# EAGLE design Wifi Shield v1.2 (EAGLE 6.4)
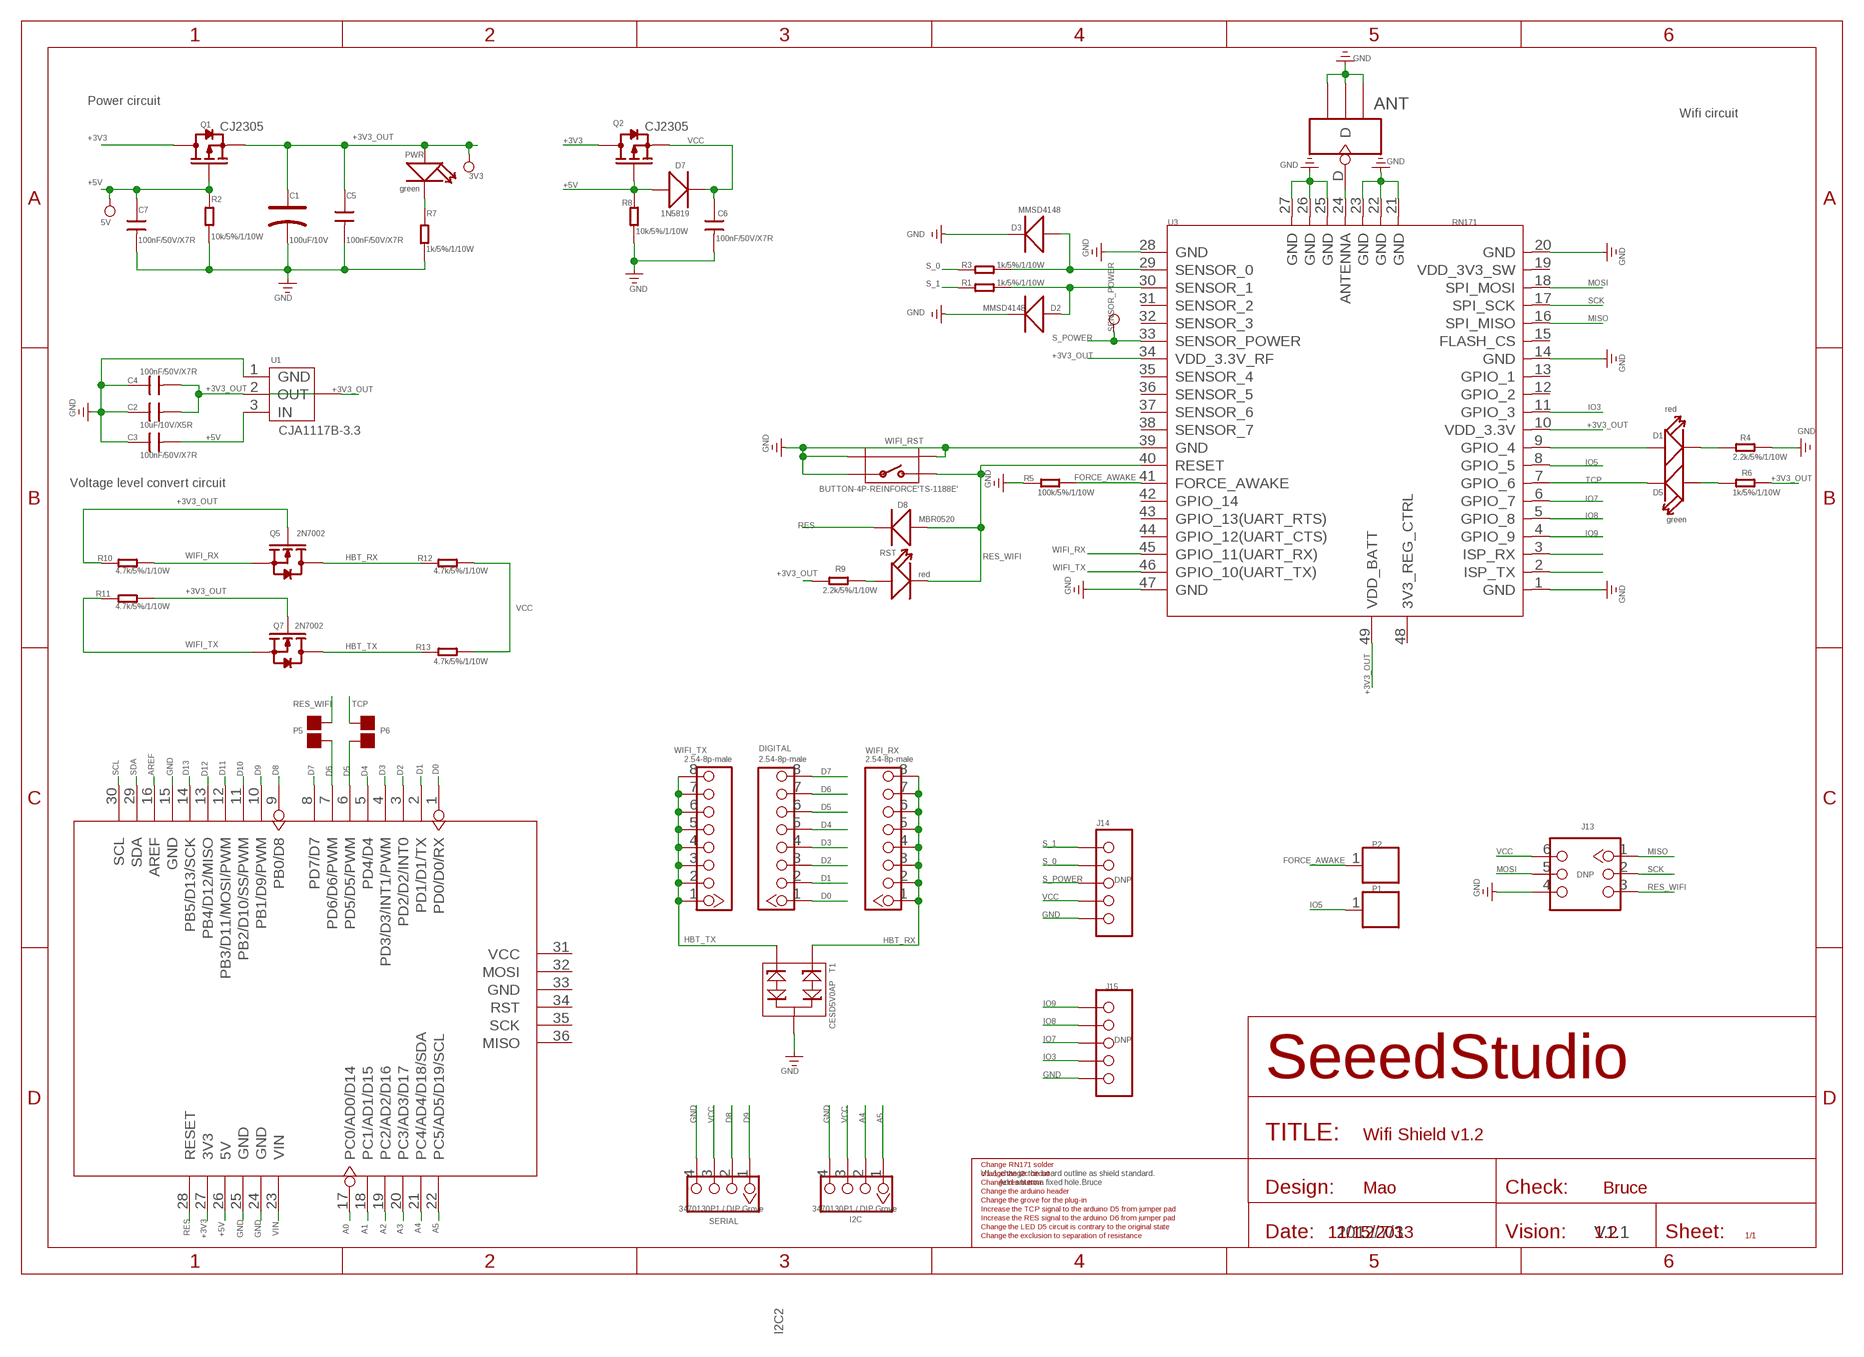
[diagram p0: schematic, sheet 1]

## Parts
3V3  PAD-TEST-POINT-CIRCLE_SIZE_3030  [TP_3535]
5V  PAD-TEST-POINT-CIRCLE_SIZE_3030  [TP_3535]
ANT1  ANT  ANTENNA-U-FL  [4P-U-FL]
C1  100uF/10V  CAP-AVX-B  [AVX-B]
C2  10uF/10V/X5R  C-0603  [0603]
C3  100nF/50V/X7R  C-0603  [0603]
C4  100nF/50V/X7R  C-0603  [0603]
C5  100nF/50V/X7R  C-0603  [0603]
C6  100nF/50V/X7R  C-0603  [0603]
C7  100nF/50V/X7R  C-0603  [0603]
D1  red  LED'0603'  [LED-0603]
D2  MMSD4148  D-MBR0520LT1  [SOD123-2.7X1.6]
D3  MMSD4148  D-MBR0520LT1  [SOD123-2.7X1.6]
D5  green  LED'0603'  [LED-0603]
D7  1N5819  D-SMA  [D2010]
D8  MBR0520  D-MBR0520LT1  [SOD123-2.7X1.6]
DIGITAL  2.54-8p-male  HEADER-8P-2.54  [8P-2.54]
I2C  3470130P1 / DIP Grove  TWIG-4P-2.0-2.0  [4P-2.0]
J13  DNP  HEADER-2X3P-2.54  [2X3P-2.54]
J14  DNP  HEADER-5P-2.54  [5P-2.54]
J15  DNP  HEADER-5P-2.54  [5P-2.54]
P1  DNP  PAD'60/30'  [1P-65/35MIL]
P2  DNP  PAD'60/30'  [1P-65/35MIL]
P5  DNP  PAD-JUMPER-2P  [2P-SMD-1.78X1.27]
P6  DNP  PAD-JUMPER-2P  [2P-SMD-1.78X1.27]
PWR  green  LED'0603'  [LED-0603]
Q1  CJ2305  MOSFET-P'SI2323CDS/SI2305DS<BR>'  [SOT23]
Q2  CJ2305  MOSFET-P'SI2323CDS/SI2305DS<BR>'  [SOT23]
Q5  2N7002  MOSFET-N'SOT23'  [SOT23]
Q7  2N7002  MOSFET-N'SOT23'  [SOT23]
R1  1k/5%/1/10W  R-0603  [0603]
R2  10k/5%/1/10W  R-0603  [0603]
R3  1k/5%/1/10W  R-0603  [0603]
R4  2.2k/5%/1/10W  R-0603  [0603]
R5  100k/5%/1/10W  R-0603  [0603]
R6  1k/5%/1/10W  R-0603  [0603]
R7  1k/5%/1/10W  R-0603  [0603]
R8  10k/5%/1/10W  R-0603  [0603]
R9  2.2k/5%/1/10W  R-0603  [0603]
R10  4.7k/5%/1/10W  R-0603  [0603]
R11  4.7k/5%/1/10W  R-0603  [0603]
R12  4.7k/5%/1/10W  R-0603  [0603]
R13  4.7k/5%/1/10W  R-0603  [0603]
RST  red  LED'0603'  [LED-0603]
SENSOR_POWER  PAD-TEST-POINT-CIRCLE_SIZE_3030  [TP_3535]
SERIAL  3470130P1 / DIP Grove  TWIG-4P-2.0-2.0  [4P-2.0]
T1  CESD5V0AP  D-ESD-PESDXL2BT  [SOT23]
U1  CJA1117B-3.3  LD1117SOT89  [SOT89]
U2  ARDUINO'W/O-SILK'  [ARDUINO-W/O-SILK]
U3  RN171  WIFI-RN-171  [49P-1.27-26.67X17.78]
WIFI_RST  BUTTON-4P-REINFORCE'TS-1188E'  [4P-SMD-7X3.5X3.5H]
WIFI_RX  2.54-8p-male  HEADER-8P-2.54  [8P-2.54]
WIFI_TX  2.54-8p-male  HEADER-8P-2.54  [8P-2.54]

## Nets
+3V3: Q1.3(D) Q2.3(D) U2.27(3V3)
+3V3_OUT: 3V3.T C1.+ C2.2 C4.2 C5.1 PWR.+ Q1.2(S) Q5.1(G) Q7.1(G) R6.1 R9.2 R10.2 R11.1 U1.2(OUT) U1.4(TAB) U3.10(VDD_3.3V) U3.34(VDD_3.3V_RF) U3.49(VDD_BATT)
+5V: 5V.T C3.2 C7.1 D7.+ Q1.1(G) Q2.1(G) R2.1 R8.1 U1.3(IN) U2.26(5V)
A0: U2.17(PC0/AD0/D14)
A1: U2.18(PC1/AD1/D15)
A2: U2.19(PC2/AD2/D16)
A3: U2.20(PC3/AD3/D17)
A4: I2C.2 U2.21(PC4/AD4/D18/SDA)
A5: I2C.1 U2.22(PC5/AD5/D19/SCL)
AREF: U2.16(AREF)
D0: DIGITAL.1 U2.1(PD0/D0/RX)
D1: DIGITAL.2 U2.2(PD1/D1/TX)
D2: DIGITAL.3 U2.3(PD2/D2/INT0)
D3: DIGITAL.4 U2.4(PD3/D3/INT1/PWM)
D4: DIGITAL.5 U2.5(PD4/D4)
D5: DIGITAL.6 P6.2 U2.6(PD5/D5/PWM)
D6: DIGITAL.7 P5.1 U2.7(PD6/D6/PWM)
D7: DIGITAL.8 U2.8(PD7/D7)
D8: SERIAL.2 U2.9(PB0/D8)
D9: SERIAL.1 U2.10(PB1/D9/PWM)
D10: U2.11(PB2/D10/SS/PWM)
D11: U2.12(PB3/D11/MOSI/PWM)
D12: U2.13(PB4/D12/MISO)
D13: U2.14(PB5/D13/SCK)
FORCE_AWAKE: P2.1 R5.1 U3.41(FORCE_AWAKE)
GND: ANT1.GND1 ANT1.GND2 ANT1.GND3 C1.- C2.1 C3.1 C4.1 C5.2 C6.2 C7.2 D2.1(-) D3.1(-) I2C.4 J13.4 J14.5 J15.5 R2.2 R4.1 R5.2 R7.1 R8.2 SERIAL.4 T1.3 U1.1(GND) U2.15(GND) U2.24(GND) U2.25(GND) U3.1(GND) U3.14(GND) U3.20(GND) U3.21(GND) U3.22(GND) U3.23(GND) U3.25(GND) U3.26(GND) U3.27(GND) U3.28(GND) U3.39(GND) U3.47(GND) WIFI_RST.1 WIFI_RST.S1 WIFI_RST.S2
HBT_RX: Q5.3(D) R12.2 T1.1 WIFI_RX.1 WIFI_RX.2 WIFI_RX.3 WIFI_RX.4 WIFI_RX.5 WIFI_RX.6 WIFI_RX.7 WIFI_RX.8
HBT_TX: Q7.3(D) R13.2 T1.2 WIFI_TX.1 WIFI_TX.2 WIFI_TX.3 WIFI_TX.4 WIFI_TX.5 WIFI_TX.6 WIFI_TX.7 WIFI_TX.8
IO3: J15.4 U3.11(GPIO_3)
IO5: P1.1 U3.8(GPIO_5)
IO7: J15.3 U3.6(GPIO_7)
IO8: J15.2 U3.5(GPIO_8)
IO9: J15.1 U3.4(GPIO_9)
MISO: J13.1 U3.16(SPI_MISO)
MOSI: J13.5 U3.18(SPI_MOSI)
N$1: R9.1 RST.+
N$2: D3.2(+) R3.1 U3.29(SENSOR_0)
N$3: D2.2(+) R1.1 U3.30(SENSOR_1)
N$4: D5.+ R6.2
N$10: U3.2(ISP_TX)
N$11: U3.3(ISP_RX)
N$20: ANT1.D U3.24(ANTENNA)
N$22: D1.+ U3.9(GPIO_4)
N$25: D1.- R4.2
N$26: PWR.- R7.2
RES: D8.1(-) U2.28(RESET)
RES_WIFI: D8.2(+) J13.3 P5.2 RST.- U3.40(RESET) WIFI_RST.2
S_0: J14.2 R3.2
S_1: J14.1 R1.2
S_POWER: J14.3 SENSOR_POWER.T U3.33(SENSOR_POWER)
SCK: J13.2 U3.17(SPI_SCK)
SCL: U2.30(SCL)
SDA: U2.29(SDA)
TCP: D5.- P6.1 U3.7(GPIO_6)
VCC: C6.1 D7.- I2C.3 J13.6 J14.4 Q2.2(S) R12.1 R13.1 SERIAL.3
VIN: U2.23(VIN)
WIFI_RX: Q5.2(S) R10.1 U3.45(GPIO_11(UART_RX))
WIFI_TX: Q7.2(S) R11.2 U3.46(GPIO_10(UART_TX))
Unconnected: U2.31(VCC) U2.32(MOSI) U2.33(GND) U2.34(RST) U2.35(SCK) U2.36(MISO) U3.12(GPIO_2) U3.13(GPIO_1) U3.15(FLASH_CS) U3.19(VDD_3V3_SW) U3.31(SENSOR_2) U3.32(SENSOR_3) U3.35(SENSOR_4) U3.36(SENSOR_5) U3.37(SENSOR_6) U3.38(SENSOR_7) U3.42(GPIO_14) U3.43(GPIO_13(UART_RTS)) U3.44(GPIO_12(UART_CTS)) U3.48(3V3_REG_CTRL)

## Notes on the sheet
- Power circuit
- Wifi circuit
- Voltage level convert circuit
- Change RN171 solder
- change the i2c circuit | V1.1:change the board outline as shield standard.
- Change res button | Add antenna fixed hole.Bruce
- Change the arduino header | Mao | Bruce
- Change the grove for the plug-in
- Increase the TCP signal to the arduino D5 from jumper pad
- Increase the RES signal to the arduino D6 from jumper pad
- Change the LED D5 circuit is contrary to the original state
- Change the exclusion to separation of resistance | 11/15/2013 | 2012/7/3 | 1.2 | V1.1
- I2C2

## Library data of the parts
3V3 5V SENSOR_POWER = Discrete:PAD-TEST-POINT-CIRCLE
ANT1 = Connector :ANTENNA-U-FL
C1 = Discrete:CAP*: Electrolytic Capacitors,Tantalum Capacitors and Super Capacitors
C2-C7 = Discrete:C*: Ceramic Capacitors
D1 D5 PWR RST = Discrete:LED*
D2 D3 D7 D8 = Discrete:D*
DIGITAL WIFI_RX WIFI_TX = Connector:HEADER-8P
I2C SERIAL = Connector:TWIG-4P-2.0
J13 = Connector:HEADER-2X3P
J14 J15 = Connector:HEADER-5P
P1 P2 = Discrete:PAD
P5 P6 = Discrete:PAD-JUMPER-2P; PARTNO: DNP
Q1 Q2 = Discrete:MOSFET-P
Q5 Q7 = Discrete:MOSFET-N: IRLL014: http://www.vishay.com/docs/91319/sihll014.pdf
R1-R13 = Discrete:R*
T1 = Discrete:D-ESD-PESDXL2BT
U1 = IC:LD1117: Low Drop Fixed And Adjustable Positive Voltage Regulators http://www.datasheetcatalog.org/datasheet/SGSThomsonMicroelectronics/mXuqtqv.pdf
U2 = template:ARDUINO
U3 = moudle:WIFI-RN-171: WIFLY GSX 802.11 b/g wireless LAN Module
WIFI_RST = Discrete:BUTTON-4P-REINFORCE: TS-1188E http://www.best-dz.com/?thread-374-2.html

## Net classes
0 default: width 0.003 mm, drill 0.254 mm, clearance 0.152 mm

## Board
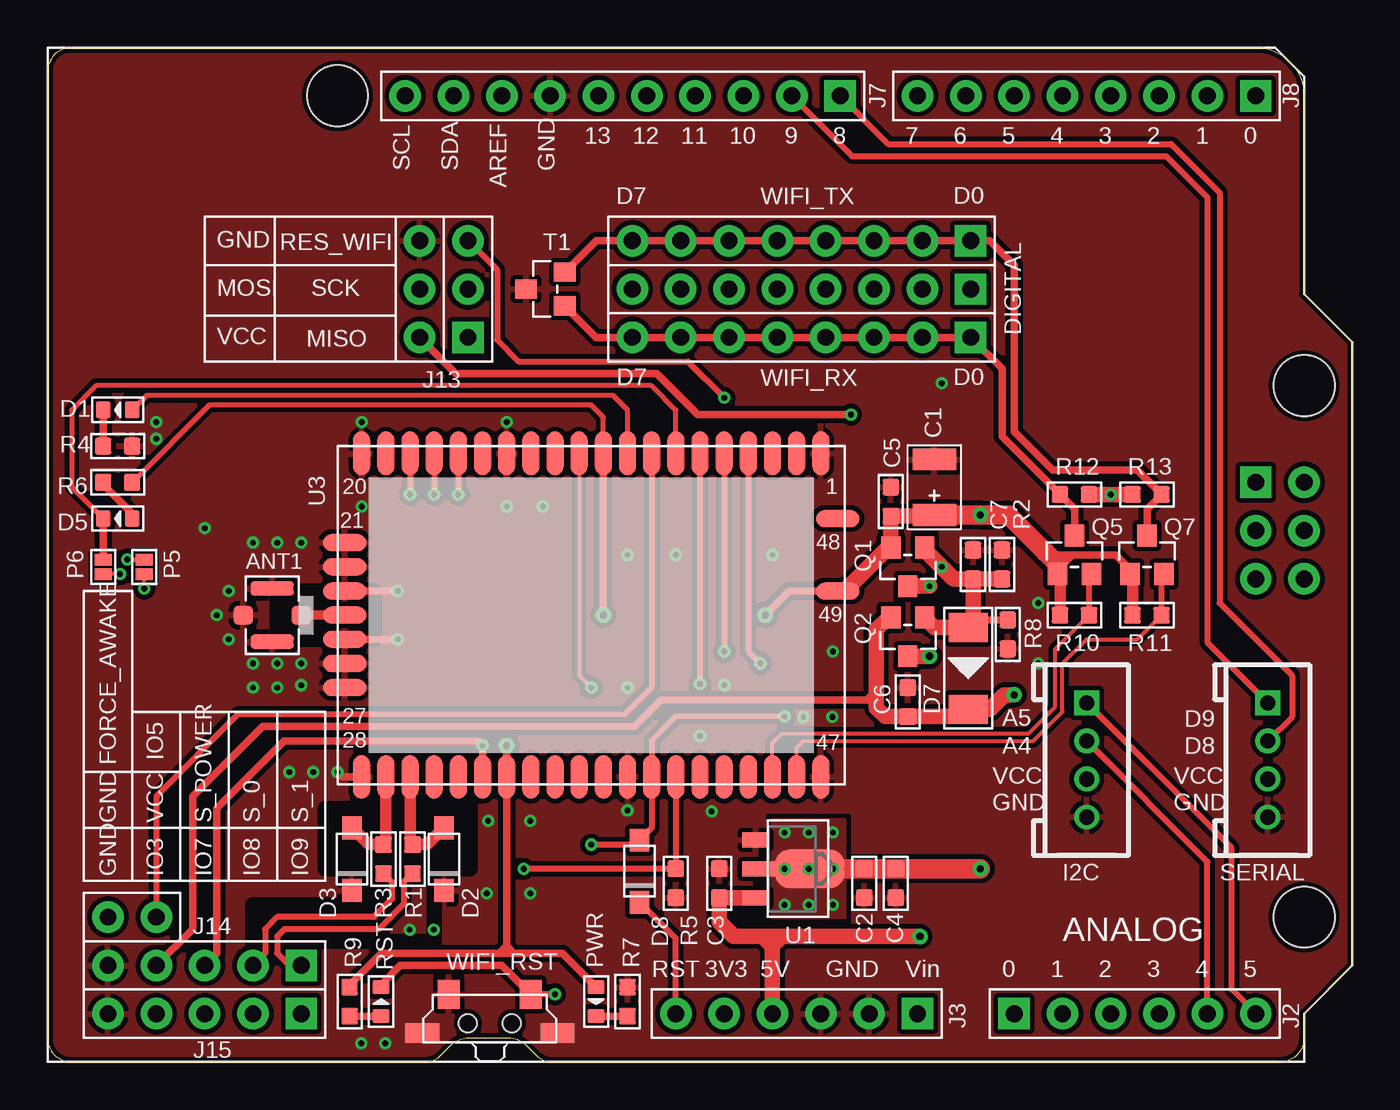
[diagram p1: board, top side]
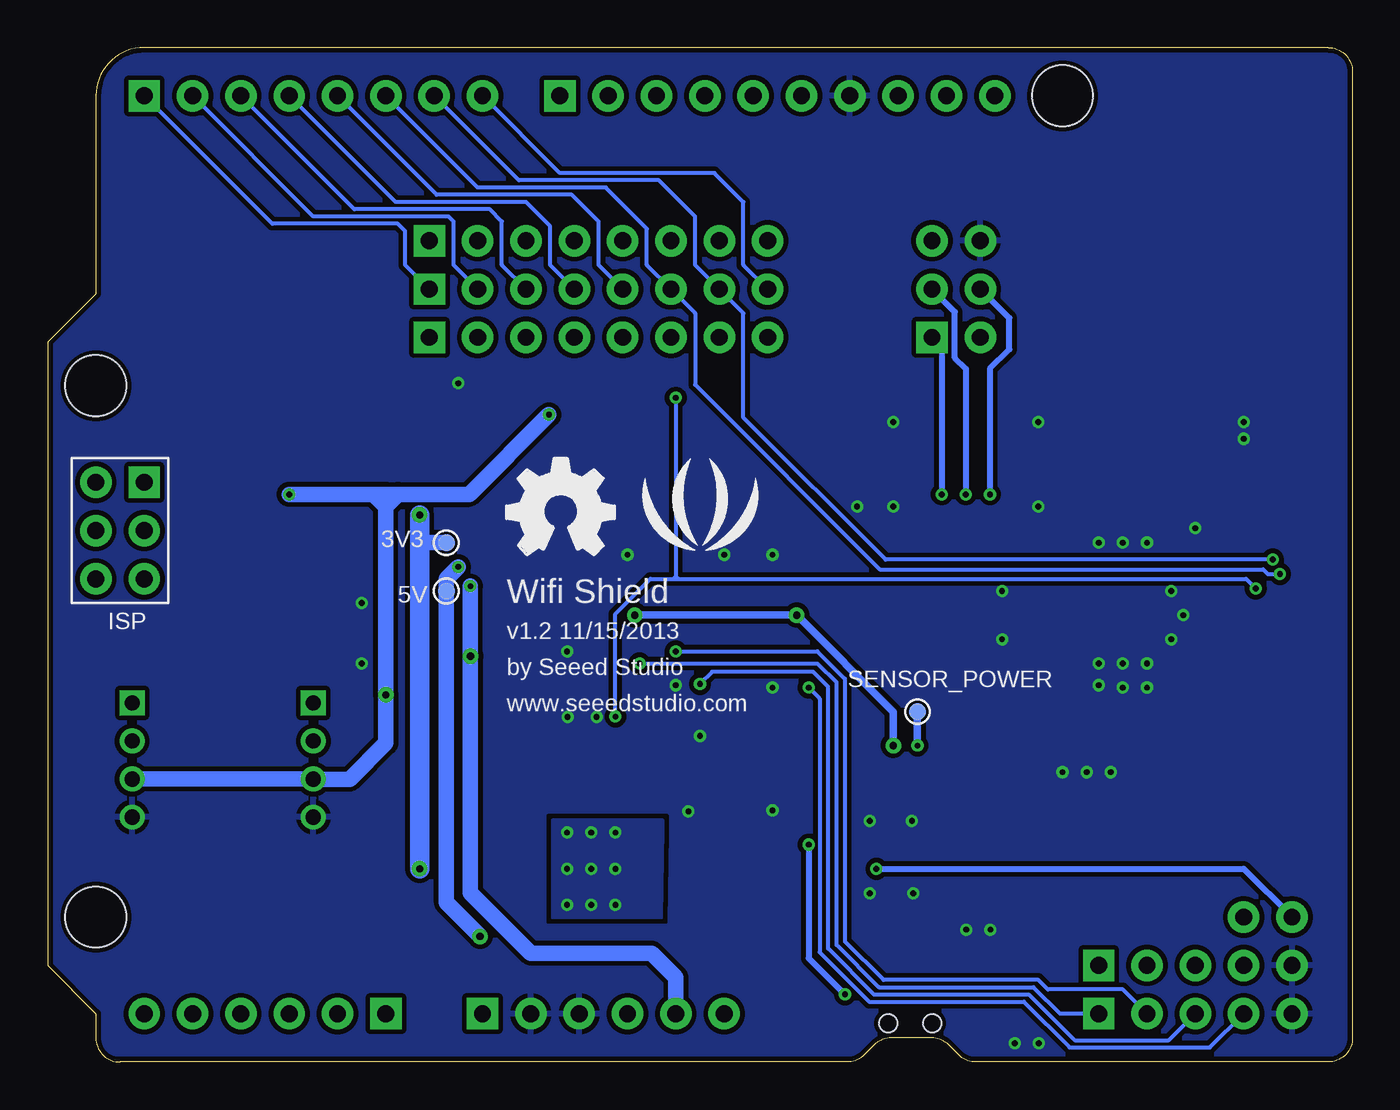
[diagram p2: board, bottom side, seen from below]

Size 68.58 x 53.34 mm. Coordinates in mm from the lower left corner, seen from the top.
Outline: 1.27,53.34 63.5,53.34 arc-90 66.04,50.8 66.04,40.39 68.58,37.85 68.58,5.08 66.04,2.54 66.04,1.27 arc-90 64.77,0 26.56,0 arc-45 25.66,0.37 25.14,0.9 arc45 24.24,1.27 22.12,1.27 arc45 21.22,0.9 20.69,0.37 arc-45 19.79,0 1.27,0 arc-90 0,1.27 0,52.07 arc-90 1.27,53.34
Copper layers (1*16): Top 0.035mm / dielectric 1.5mm / Bottom 0.035mm
Design rules "default": minimum track width 6mil, minimum drill 12mil, track to track 6mil, track to pad 6mil, pad to pad 6mil, via to via 6mil, smd to smd 0mil, copper to edge 10mil, drill to drill 10mil, minimum pad ring 10mil, minimum via ring 6mil, stop-mask expansion 2mil, vias tented up to drill 32mil, thermal gap 10mil
tRestrict: 18 lines

### Footprints (pad centres in the part's own frame; a part is rotated, then mirrored left to right if it is on the bottom)
TP_3535 = smd 0.889 x 0.889: T 0,0
4P-U-FL = smd 1.016 x 1.016: D -1.524,0; GND3 1.524,0 | smd 2.286 x 0.762: GND1 0,1.397; GND2 0,-1.397
AVX-B = smd 1.143 x 2.286: + -1.46,0; - 1.46,0
0603 = smd 0.889 x 0.889: 1 -0.762,0; 2 0.762,0
LED-0603 = smd 0.762 x 0.889: + -0.762,0; - 0.762,0
SOD123-2.7X1.6 = smd 1.2 x 1.02: 1 -1.635,0; 2 1.635,0
D2010 = smd 1.524 x 2.032: + -2.159,0; - 2.159,0
8P-2.54 = drill 0.889 pad 1.651 square: 1 0,8.89 | drill 0.889 pad 1.651: 2 0,6.35; 3 0,3.81; 4 0,1.27; 5 0,-1.27; 6 0,-3.81; 7 0,-6.35; 8 0,-8.89
4P-2.0 = drill 0.8 pad 1.27 square: 1 -3,0 | drill 0.8 pad 1.27: 2 -1,0; 3 1,0; 4 3,0
2X3P-2.54 = drill 0.889 pad 1.651 square: 1 -1.27,2.54 | drill 0.889 pad 1.651: 2 -1.27,0; 3 -1.27,-2.54; 4 1.27,-2.54; 5 1.27,0; 6 1.27,2.54
5P-2.54 = drill 0.889 pad 1.651 square: 1 0,5.08 | drill 0.889 pad 1.651: 2 0,2.54; 3 0,0; 4 0,-2.54; 5 0,-5.08
1P-65/35MIL = drill 0.889 pad 1.651: 1 0,0
2P-SMD-1.78X1.27 = smd 0.889 x 0.61: 1 0,0.381; 2 0,-0.381
SOT23 = smd 1.016 x 1.143: 1 -0.889,-1.016; 2 0.889,-1.016; 3 0,1.016
SOT89 = smd 0.8 x 1.4: 1 -1.524,-1.905; 3 1.524,-1.905 | smd 0.8 x 1.9: 2 0,-1.651 | smd 2.032 x 3.65: 4 0,0.94
ARDUINO-W/O-SILK = drill 0.889 pad 1.651 square: 1 63.5,50.8; 9 41.656,50.8; 17 50.8,2.54; 23 45.72,2.54; 36 63.5,30.48 | drill 0.889 pad 1.651: 2 60.96,50.8; 3 58.42,50.8; 4 55.88,50.8; 5 53.34,50.8; 6 50.8,50.8; 7 48.26,50.8; 8 45.72,50.8; 10 39.116,50.8; 11 36.576,50.8; 12 34.036,50.8; 13 31.496,50.8; 14 28.956,50.8; 15 26.416,50.8; 16 23.876,50.8; 18 53.34,2.54; 19 55.88,2.54; 20 58.42,2.54; 21 60.96,2.54; 22 63.5,2.54; 24 43.18,2.54; 25 40.64,2.54; 26 38.1,2.54; 27 35.56,2.54; 28 33.02,2.54; 29 21.336,50.8; 30 18.796,50.8; 31 66.04,30.48; 32 66.04,27.94; 33 66.04,25.4; 34 63.5,25.4; 35 63.5,27.94 | hole 3.2: 15.24,50.8; 66.04,35.56; 66.04,7.62
49P-1.27-26.67X17.78 = smd 0.889 x 2.286: 1 12.065,8.509; 2 10.795,8.509; 3 9.525,8.509; 4 8.255,8.509; 5 6.985,8.509; 6 5.715,8.509; 7 4.445,8.509; 8 3.175,8.509; 9 1.905,8.509; 10 0.635,8.509; 11 -0.635,8.509; 12 -1.905,8.509; 13 -3.175,8.509; 14 -4.445,8.509; 15 -5.715,8.509; 16 -6.985,8.509; 17 -8.255,8.509; 18 -9.525,8.509; 19 -10.795,8.509; 20 -12.065,8.509; 28 -12.065,-8.509; 29 -10.795,-8.509; 30 -9.525,-8.509; 31 -8.255,-8.509; 32 -6.985,-8.509; 33 -5.715,-8.509; 34 -4.445,-8.509; 35 -3.175,-8.509; 36 -1.905,-8.509; 37 -0.635,-8.509; 38 0.635,-8.509; 39 1.905,-8.509; 40 3.175,-8.509; 41 4.445,-8.509; 42 5.715,-8.509; 43 6.985,-8.509; 44 8.255,-8.509; 45 9.525,-8.509; 46 10.795,-8.509; 47 12.065,-8.509 | smd 2.286 x 0.889: 21 -12.954,3.81; 22 -12.954,2.54; 23 -12.954,1.27; 24 -12.954,0; 25 -12.954,-1.27; 26 -12.954,-2.54; 27 -12.954,-3.81; 48 12.954,5.08; 49 12.954,1.27
4P-SMD-7X3.5X3.5H = smd 1.143 x 1.524: 1 -2.159,1.524; 2 2.159,1.524 | smd 1.778 x 1.016: S1 -3.556,-0.508; S2 3.556,-0.508 | hole 0.95: -1.15,0; 1.15,0

### Placement (x,y rotation side)
3V3  47.62,27.3 180 bottom
5V  47.62,24.77 0 bottom
ANT1  11.81,23.5 180 top
C1  46.61,30.23 90 top
C2  42.93,9.4 90 top
C3  35.31,9.4 270 top
C4  44.58,9.4 90 top
C5  44.32,29.46 90 top
C6  45.21,18.92 90 top
C7  48.64,26.16 90 top
D1  3.68,34.29 180 top
D2  20.83,10.67 90 top
D3  16,10.67 90 top
D5  3.68,28.57 180 top
D7  48.39,20.7 270 top
D8  31.11,10.03 90 top
DIGITAL  39.62,40.64 270 top
I2C  54.61,15.88 270 top
J13  20.83,40.64 180 top
J14  8.26,5.08 270 top
J15  8.26,2.54 270 top
P1  5.71,7.62 0 top
P2  3.17,7.62 0 top
P5  5.08,26.04 0 top
P6  2.92,26.04 0 top
PWR  28.83,3.17 270 top
Q1  45.21,26.04 180 top
Q2  45.21,22.35 180 top
Q5  53.98,26.67 0 top
Q7  57.78,26.67 0 top
R1  19.18,10.67 270 top
R2  50.16,26.16 90 top
R3  17.65,10.67 270 top
R4  3.68,32.38 180 top
R5  33.02,9.4 270 top
R6  3.68,30.48 180 top
R7  30.48,3.17 270 top
R8  50.47,22.48 270 top
R9  15.88,3.17 90 top
R10  53.98,23.5 180 top
R11  57.78,23.5 0 top
R12  53.98,29.84 180 top
R13  57.78,29.84 0 top
RST  17.53,3.17 90 top
SENSOR_POWER  22.86,18.41 0 bottom
SERIAL  64.14,15.88 270 top
T1  26.16,40.64 90 top
U1  39.12,10.16 270 top
U2  0,0 0 top
U3  28.57,23.5 0 top
U$1  [OSHW_FILLX200_NOTEXT]  44.45,26.67 0 bottom
U$2  [LOGO_SILK]  34.29,28.57 0 bottom
WIFI_RST  23.24,2.03 0 top
WIFI_RX  39.62,38.1 270 top
WIFI_TX  39.62,43.18 270 top

### Tracks (layer width: path | path; a pad name or v marks a point on that pad's centre or on a via)
+3V3  (via drill 0.3 pad 0.64, 0.38 pad 0.81)
  Top 0.813: Q2.3 v46.35,21.34 | v46.35,25.02 Q1.3
  Bottom 0.813: v46.35,25.02 v46.35,21.34 46.35,8.89 43.18,5.71 36.83,5.71 35.56,4.45 U2.27
+3V3_OUT  (via drill 0.3 pad 0.64, 0.38 pad 0.81)
  Top 0.254: U3.10 29.21,33.91 28.57,34.54 8.51,34.54 R6.1
  Top 0.406: Q7.1 56.9,25.91 56.13,26.67 53.85,26.67 | 53.85,26.67 53.09,25.91 Q5.1 | 53.85,26.67 52.58,26.67 52.45,26.8 | v29.21,23.5 U3.10 | v24.13,16.64 U3.34 24.13,6.1 | 24.13,6.1 24.13,5.71 | R9.2 15.88,4.06 17.53,5.71 23.75,5.71 | PWR.+ 27.05,5.71 24.51,5.71 | 24.13,5.71 24.51,5.71 | 41.91,24.77 U3.49 38.99,24.77 v37.72,23.5 | 24.13,6.1 24.51,5.71 | 24.13,6.1 23.75,5.71 | 23.75,5.71 24.13,5.71
  Top 0.61: R10.2 53.21,25.53 Q5.1 53.09,26.16 | R11.1 57.02,25.53 Q7.1
  Top 0.813: 41.91,24.77 44.2,27.05 Q1.2 C5.1 46.55,28.7 C1.+ 47.31,28.77 | C4.2 C2.2 v41.27,10.16 U1.4 U1.2
  Top 1.016: v49.02,10.16 C4.2 v41.27,10.16 | 53.09,26.16 52.45,26.8 50.48,28.77 v49.02,28.77 47.31,28.77
  Bottom 0.406: v37.72,23.5 v29.21,23.5 24.13,18.41 v24.13,16.64
  Bottom 0.813: 3V3.T 48.9,27.3 49.02,27.43
  Bottom 1.016: v49.02,10.16 49.02,27.43 v49.02,28.77
  other vias: 38.73,12.06 38.73,10.16 38.73,8.26 41.27,8.26 41.27,12.06 40.01,12.06 40.01,10.16 40.01,8.26
  pour Top (isolate 0.254, no thermals): 41.91,12.7 38.1,12.7 38.1,7.62 41.91,7.62
  pour Bottom (isolate 0.254, no thermals): 36.26,12.26 36.26,12.7 42.04,12.7 42.04,7.62 36.32,7.62
+5V  (via drill 0.3 pad 0.64, 0.38 pad 0.81)
  Top 0.406: R8.1 48.77,23.24
  Top 0.813: D7.+ 46.61,22.86 Q2.1 | D7.+ 48.64,23.11 C7.1 | 48.77,23.24 D7.+ | U1.3 C3.2 35.31,7.37 36.07,6.6 37.59,6.6 | v45.85,6.6 37.97,6.6 | 37.97,6.6 37.59,6.6 | 38.1,6.1 38.1,6.48 37.97,6.6 | 38.1,6.1 37.59,6.6 | 38.1,6.1 38.48,6.48 | C7.1 R2.1 | 38.1,6.1 U2.26 | C7.1 47.62,25.4 v46.99,26.04 46.1,26.92 Q1.1
  Bottom 0.813: v45.85,6.6 47.62,8.38 5V.T 47.62,25.4 v46.99,26.04
A4
  Top 0.305: U2.21 60.96,10.53 I2C.2
A5
  Top 0.305: U2.22 62.23,3.81 62.23,11.26 I2C.1
D0
  Bottom 0.203: DIGITAL.1 49.78,41.91 49.78,43.69 50.16,44.07 56.77,44.07 U2.1
D1
  Bottom 0.203: DIGITAL.2 47.24,41.91 47.24,44.2 47.5,44.45 54.61,44.45 U2.2
D2
  Bottom 0.203: DIGITAL.3 44.7,41.91 44.7,44.2 45.34,44.83 52.45,44.83 U2.3
D3
  Bottom 0.203: DIGITAL.4 42.16,41.91 42.16,43.94 43.43,45.21 50.29,45.21 U2.4
D4
  Bottom 0.203: DIGITAL.5 39.62,41.91 39.62,44.2 41.02,45.59 48.13,45.59 U2.5
D5  (via drill 0.3 pad 0.64)
  Top 0.203: v3.81,25.65 P6.2
  Bottom 0.203: U2.6 45.97,45.97 39.24,45.97 37.08,43.81 37.08,41.91 DIGITAL.6 34.54,39.37 34.54,35.61 24.84,25.91 4.7,25.91 4.45,25.65 v3.81,25.65
D6  (via drill 0.3 pad 0.64)
  Top 0.203: v4.19,26.42 P5.1
  Bottom 0.203: U2.7 43.81,46.35 36.45,46.35 34.54,44.45 34.54,41.91 DIGITAL.7 32,39.37 32,33.88 24.54,26.42 v4.19,26.42
D7
  Bottom 0.203: DIGITAL.8 32,41.91 32,45.21 33.53,46.74 41.66,46.74 U2.8
D8
  Top 0.305: U2.9 44.2,48.26 59.05,48.26 61.59,45.72 61.59,24.13 65.41,20.32 65.41,18.14 SERIAL.2
D9
  Top 0.305: U2.10 42.29,47.62 58.8,47.62 60.96,45.47 60.96,22.05 SERIAL.1
FORCE_AWAKE  (via drill 0.3 pad 0.64)
  Top 0.305: U3.41 R5.1 v25.02,10.16
  Bottom 0.305: v25.02,10.16 5.71,10.16 P2.1
GND  (via drill 0.3 pad 0.64)
  Top 0.406: U3.23 v18.41,24.77 | U3.25 v18.41,22.23 | U3.28 15.49,14.99 v15.24,15.24
  other vias: 30.48,13.23 34.9,13.18 13.34,19.81 46.99,35.69 24.13,29.21 30.48,19.68 35.56,19.81 41.27,21.59 34.29,17.14 23.09,8.86 25.37,8.86 13.34,27.3 8.26,28.07 26.04,29.21 16.51,29.21 23.15,12.67 25.37,12.67 30.48,26.67 33.02,26.67 52.07,20.95 52.07,24.13 5.71,33.66 5.71,32.77 13.97,15.24 12.7,15.24 8.89,23.5 9.53,24.77 9.53,22.23 13.34,20.95 12.06,20.95 10.79,20.95 12.06,19.68 10.79,19.68 12.06,27.3 10.79,27.3 16.48,0.99 17.75,0.99 19.02,6.96 20.29,6.96 39.73,18.14 41.25,18.14 38.1,26.67 24.13,33.66 16.51,33.66
  pour Top (isolate 0.254, rank 6): 0,53.34 68.58,53.34 68.58,0 0,0
  pour Bottom (isolate 0.254, rank 6): 0,53.34 68.58,53.34 68.58,0 0,0
HBT_RX
  Top 0.406: Q5.3 53.98,29.08 R12.2 50.16,32.89 50.16,36.45 WIFI_RX.1 WIFI_RX.2 WIFI_RX.3 WIFI_RX.4 WIFI_RX.5 WIFI_RX.6 WIFI_RX.7 WIFI_RX.8 28.83,38.1 T1.1
HBT_TX
  Top 0.406: Q7.3 57.78,29.08 R13.2 57.28,31.11 52.83,31.11 50.8,33.15 50.8,41.91 49.53,43.18 WIFI_TX.1 WIFI_TX.2 WIFI_TX.3 WIFI_TX.4 WIFI_TX.5 WIFI_TX.6 WIFI_TX.7 WIFI_TX.8 28.83,43.18 T1.2
IO3  (via drill 0.3 pad 0.64)
  Top 0.203: 28.19,20.07 v28.57,19.68 27.94,20.32 U3.11
  Bottom 0.203: v28.57,19.68 28,19.11 28,5.78 25.4,3.17 17.27,3.17 14.86,0.76 7.49,0.76 J15.4
IO5
  Top 0.305: P1.1 5.71,13.97 10.03,18.29 30.35,18.29 31.75,19.68 U3.8
IO7  (via drill 0.3 pad 0.64)
  Top 0.305: U3.6 v34.29,19.88
  Bottom 0.203: v34.29,19.88 33.65,20.51 28.34,20.51 27.56,19.73 27.56,5.97 25.15,3.56 17.02,3.56 14.61,1.14 9.65,1.14 J15.3
IO8  (via drill 0.3 pad 0.64)
  Top 0.305: U3.5 v35.56,21.59
  Bottom 0.203: J15.2 12.06,3.81 16,3.81 16.51,4.32 24.64,4.32 26.67,6.35 26.67,20.14 28.12,21.59 v35.56,21.59
IO9  (via drill 0.3 pad 0.64)
  Top 0.305: U3.4 36.83,21.59 v37.47,20.95
  Bottom 0.203: J15.1 15.37,2.54 16.76,3.94 24.89,3.94 27.11,6.16 27.11,19.95 28.12,20.95 v37.47,20.95
MISO  (via drill 0.3 pad 0.64)
  Top 0.305: U3.16 v21.59,29.84
  Bottom 0.305: v21.59,29.84 21.59,37.59 J13.1
MOSI  (via drill 0.3 pad 0.64)
  Top 0.305: U3.18 v19.05,29.84
  Bottom 0.305: v19.05,29.84 19.05,36.45 18.03,37.47 18.03,39.12 J13.5
N$1
  Top 0.406: R9.1 RST.+
N$2
  Top 0.152: D3.2 16,12.32
  Top 0.61: 16,12.32 16.89,11.43 R3.1 17.78,11.56 U3.29
N$3
  Top 0.61: D2.2 19.95,11.43 R1.1 19.05,11.56 U3.30
N$4
  Top 0.406: R6.2 2.92,30.35 4.45,28.83 D5.+
N$20
  Top 0.508: U3.24 ANT1.D
N$22
  Top 0.254: U3.9 30.48,34.29 29.72,35.05 5.21,35.05 D1.+
N$25
  Top 0.406: R4.2 D1.-
N$26
  Top 0.406: R7.2 PWR.-
RES
  Top 0.305: U2.28 33.02,6.49 D8.1
RES_WIFI  (via drill 0.3 pad 0.64)
  Top 0.203: 30.97,11.81 D8.2 | v5.08,24.89 P5.2
  Top 0.305: v38.73,18.16 33.02,18.16 31.75,16.89 U3.40 31.75,12.3 D8.2 30.88,11.43 v28.57,11.43 | J13.3 23.62,41.66 23.62,37.97 24.77,36.83 33.66,36.83 v35.56,34.92 | v26.67,3.56 WIFI_RST.2
  Top 0.406: RST.- 17.53,4.06 18.54,5.08 23.88,5.08 WIFI_RST.2
  Bottom 0.203: 35.69,25.4 36.9,25.4 38.73,23.57 v38.73,18.16 | 35.69,25.4 35.56,25.4 | v35.56,34.92 35.56,25.53 | 35.56,25.53 35.56,25.4 | 35.56,25.4 35.43,25.4 | 35.43,25.4 5.59,25.4 v5.08,24.89 | 35.56,25.53 35.69,25.4 | 35.43,25.4 35.56,25.53
  Bottom 0.305: v28.57,11.43 28.57,5.46 v26.67,3.56
S_0
  Top 0.305: R3.2 18.1,9.46 18.1,8.57 17.14,7.62 12.06,7.62 11.43,6.99 11.43,5.71 J14.2
S_1
  Top 0.305: R1.2 18.73,9.46 18.73,8.32 17.4,6.99 12.45,6.99 12.06,6.6 12.06,5.71 12.7,5.08 J14.1
S_POWER  (via drill 0.3 pad 0.64)
  Top 0.406: J14.3 8.89,5.71 8.89,13.34 12.45,16.89 22.61,16.89 v22.86,16.64 U3.33
  Bottom 0.406: v22.86,16.64 SENSOR_POWER.T
SCK  (via drill 0.3 pad 0.64)
  Top 0.305: U3.17 v20.32,29.84
  Bottom 0.305: v20.32,29.84 20.32,36.45 20.89,37.02 20.89,39.43 J13.2
TCP
  Top 0.254: U3.7 33.02,34.29 31.75,35.56 2.54,35.56 1.27,34.29 1.27,30.23 D5.-
  Top 0.406: P6.1 D5.-
VCC  (via drill 0.3 pad 0.64, 0.38 pad 0.81)
  Top 0.152: Q2.2 44.07,23.37 44.13,23.3 | D7.- 48.39,18.16
  Top 0.406: 43.05,19.05 32.26,19.05 30.86,17.65 11.3,17.65 7.62,13.97 7.62,6.99 J14.4 | 43.18,19.05 43.31,19.05 43.56,19.3 43.31,19.3 43.05,19.05 | 43.05,19.05 43.18,19.05 | 43.18,19.05 43.43,18.8 | J13.6 21.46,36.2 32,36.2 34.16,34.04 v42.23,34.04
  Top 0.813: 48.39,18.16 C6.1 44.02,18.16 43.56,18.62 43.56,19.3 43.56,22.73 44.13,23.3 44.2,23.37 | R13.1 v55.88,29.84 R12.1 | v50.8,19.3 50.29,19.3 49.53,18.54 D7.-
  Bottom 0.813: I2C.3 SERIAL.3 | I2C.3 54.34,14.88 | 50.8,29.21 v50.8,19.3 50.8,16.76 52.7,14.86 54.59,14.86 I2C.3 | 50.8,29.21 50.8,29.84 | 51.18,29.84 v55.88,29.84 | 50.8,29.84 50.16,29.84 | 50.16,29.84 46.42,29.84 v42.23,34.04 | 50.16,29.84 50.8,29.21 | 50.8,29.21 51.31,29.72 51.18,29.84 | 50.8,29.84 51.18,29.84
WIFI_RX
  Top 0.203: U3.45 38.1,16.76 38.61,17.27 51.56,17.27 52.96,18.67 52.96,21.72 R10.1
  Top 0.305: R10.1 54.74,25.53 Q5.2
WIFI_TX
  Top 0.203: U3.46 39.37,16.51 39.75,16.89 51.82,16.89 53.34,18.41 53.34,20.95 54.61,22.23 57.28,22.23 R11.2
  Top 0.305: R11.2 58.55,25.53 Q7.2

### Text on the board
tPlace: J7 | J8 | 13 | 12 | 11 | 10 | 9 | 8 | 7 | 6 | 5 | 4 | 3 | 2 | 1 | 0 | SCL | SDA | GND | AREF | D7 | D0 | GND | RES_WIFI | MOSI | SCK | VCC | MISO | D7 | D0 | A5 | D9 | FORCE_AWAKE | IO5 | A4 | D8 | VCC | VCC | GND | VCC | S_POWER | S_0 | S_1 | GND | GND | GND | IO3 | IO7 | IO8 | IO9 | ANALOG | RST | 3V3 | 5V | GND | Vin | 0 | 1 | 2 | 3 | 4 | 5 | J3 | J2
bPlace: Wifi Shield | ISP | v1.2 11/15/2013 | by Seeed Studio | www.seeedstudio.com